# Altium schematic sheet heater-control.SchDoc: Heater Control
size A; DrawnBy: B. Almeida, D. Vogel; Organization: UTAT SS; Revision: 1.0
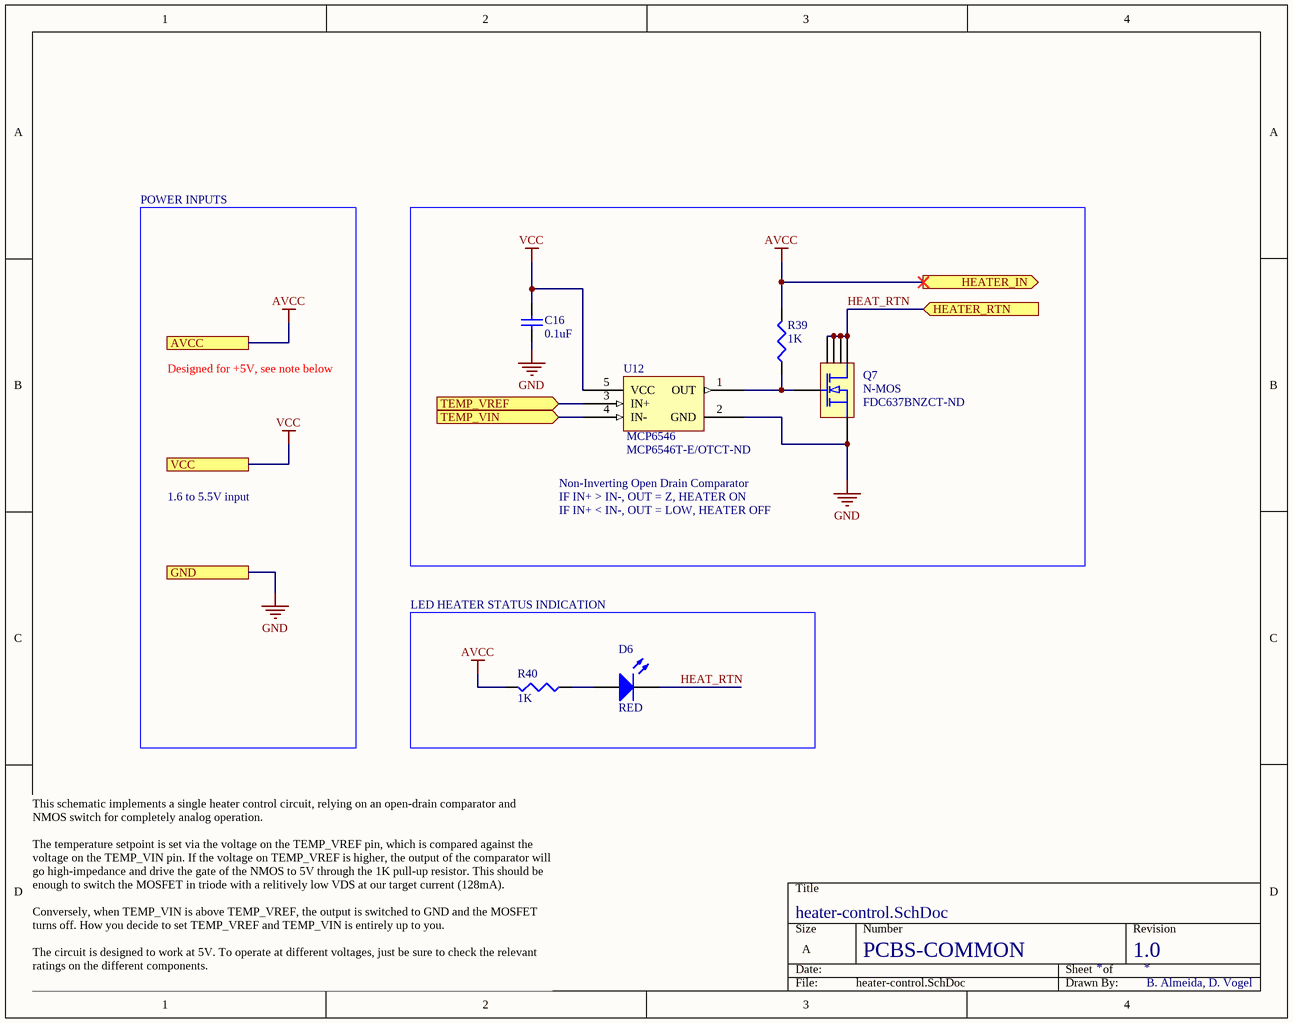
[diagram p0: heater-control.SchDoc]

## Parts
C16  value 0.1uF  [1608[0603]]  (hidden comment: 100pF)
D6  RED  [0603-LED]
Q7  N-MOS  [SOT95P280X145-6N]
R39  1K  [J1-0603]
R40  1K  [J1-0603]
U12  MCP6546  Supplier Part Number 1: MCP6546T-E/OTCT-ND  [SOT-23-5_95P290X160-5N]

## Blocks framed on the sheet
LED HEATER STATUS INDICATION: D6 R40

## Ports
AVCC, GND, HEATER_IN (out), HEATER_RTN (in), TEMP_VIN (in), TEMP_VREF (in), VCC

## Nets
AVCC: R39.2 R40.2 ; port AVCC, port HEATER_IN
GND: C16.1 Q7.4(S) U12.2(GND) ; port GND
VCC: C16.2 U12.5(VCC) ; port VCC
HEAT_RTN: D6.2(K) Q7.1(D) Q7.2(D) Q7.5(D) Q7.6(D) ; port HEATER_RTN
TEMP_VIN: U12.4(IN-) ; port TEMP_VIN
TEMP_VREF: U12.3(IN+) ; port TEMP_VREF
NetD6_1: D6.1(A) R40.1
NetQ7_3: Q7.3(G) R39.1 U12.1(OUT)

## Notes on the sheet
- POWER INPUTS
- Designed for +5V, see note below
- 1.6 to 5.5V input
- Non-Inverting Open Drain Comparator
- IF IN+ > IN-, OUT = Z, HEATER ON
- IF IN+ < IN-, OUT = LOW, HEATER OFF
- PCBS-COMMON
- This schematic implements a single heater control circuit, relying on an open-drain comparator and NMOS switch for completely analog operation.
  The temperature setpoint is set via the voltage on the TEMP_VREF pin, which is compared against the voltage on the TEMP_VIN pin. If the voltage on TEMP_VREF is higher, the output of the comparator will go high-impedance and drive the gate of the NMOS to 5V through the 1K pull-up resistor. This should be enough to switch the MOSFET in triode with a relitively low VDS at our target current (128mA).
  Conversely, when TEMP_VIN is above TEMP_VREF, the output is switched to GND and the MOSFET turns off. How you decide to set TEMP_VREF and TEMP_VIN is entirely up to you.
  The circuit is designed to work at 5V. To operate at different voltages, just be sure to check the relevant ratings on the different components.

## Library data of the parts
C16 = Cap Semi: Capacitor (Semiconductor SIM Model); Published: 8-Jun-2000; LatestRevisionDate: 29-May-2009; LatestRevisionNote: IPC-7351 Footprint Added.; PackageReference: C1206; Publisher: Altium Limited; PackageDescription: Chip Capacitor; Supplier: Digi-Key; Supplier Part Number: 490-1351-1-ND; Supplier 1: Digi-Key
D6 = LED2: Typical RED, GREEN, YELLOW, AMBER GaAs LED; Published: 8-Jun-2000; LatestRevisionDate: 17-Jul-2002; LatestRevisionNote: Re-released for DXP Platform.; PackageVersion: Feb-2002; PackageReference: 3.2X1.6X1.1; Publisher: Altium Limited; PackageDescription: SM LED; 2 Flat Leads; Supplier 1: Digi-Key; Supplier: Digi-Key
Q7 = FDC637BNZCT-ND: N-MOS, low gate ON voltage; Supplier: Digi-Key; Supplier Part Number: FDC637BNZCT-ND
R39 R40 = Res3: Resistor; Published: 8-Jun-2000; LatestRevisionDate: 29-May-2009; LatestRevisionNote: IPC-7351 Footprint Added.; PackageReference: J1-0603; Publisher: Altium Limited; PackageDescription: Chip Resistor; Value: 1K; Supplier: Digi-Key; Supplier 1: Digi-Key
  R39: Supplier Part Number: RNCP0603FTD1K00CT-ND
  R40: Supplier Part Number: RMCF0603JT510RCT-ND
U12 = MCP6546: Open-drain output sub-microamp comparator.; Supplier 1: Digi-Key; Supplier: Digi-Key; Supplier Part Number: MCP6546T-E/OTCT-ND